# Altium schematic sheet Glands.SchDoc
size Letter; DocumentNumber: 4; SheetNumber: 4; SheetTotal: 11; Pagesize: Letter
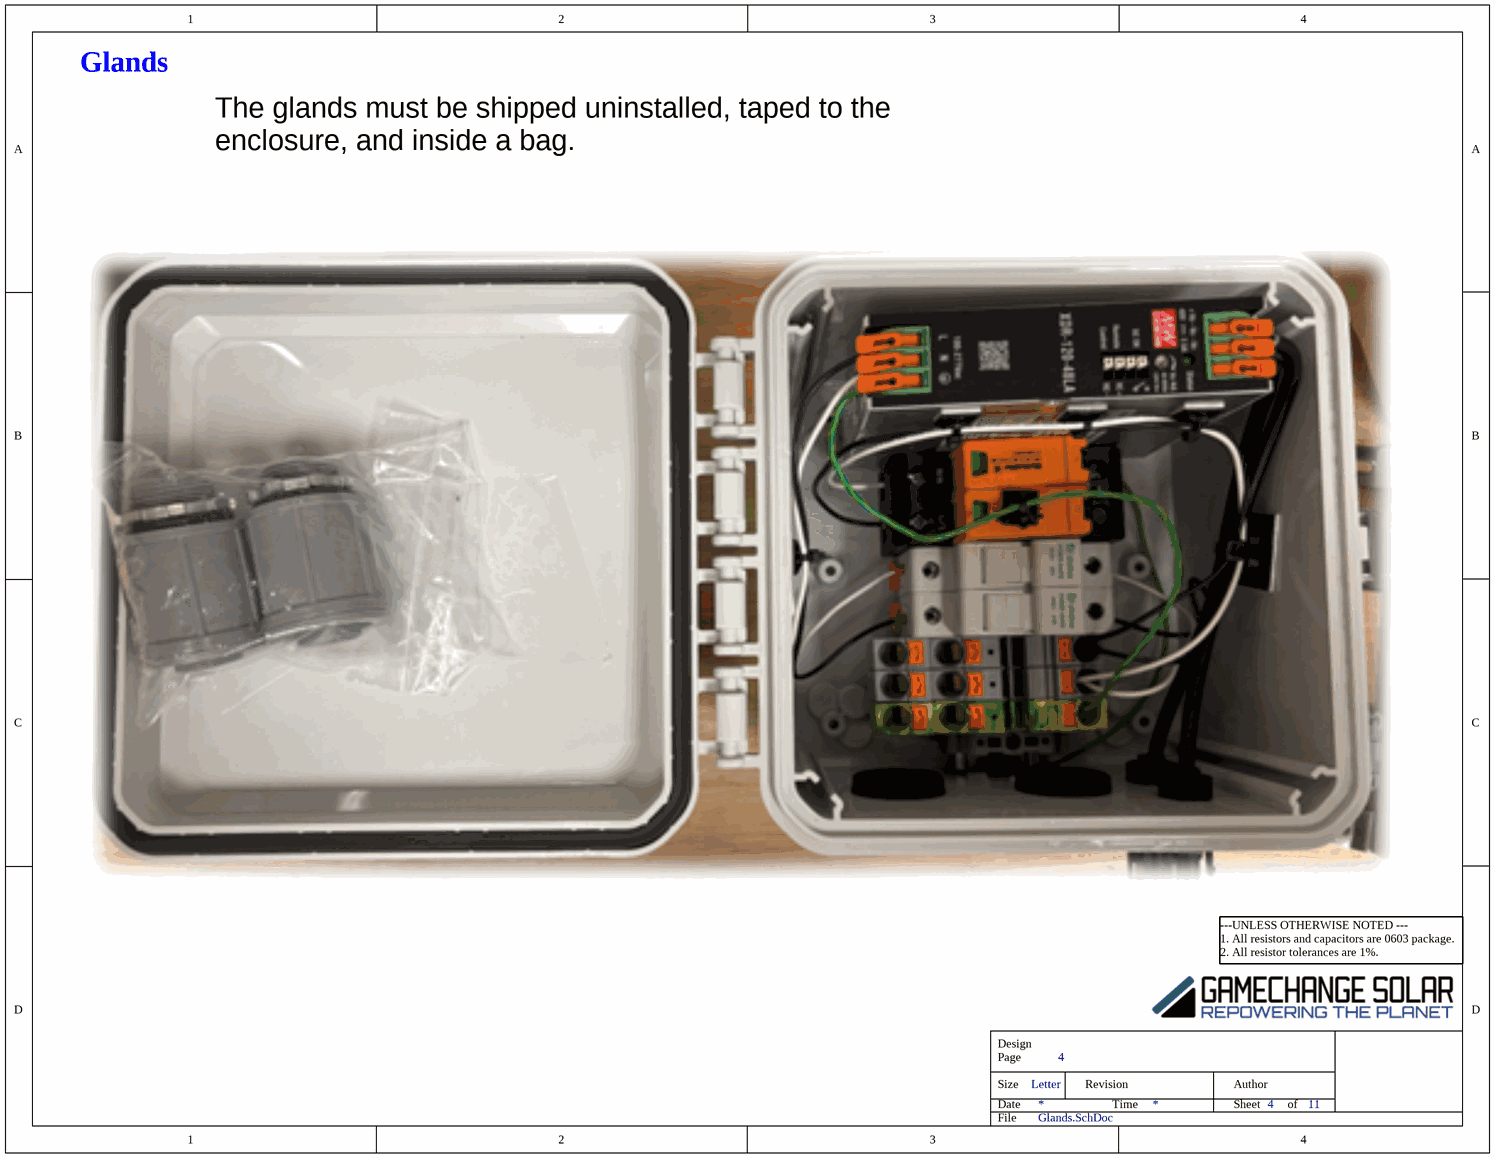
[diagram p0: Glands.SchDoc]

## Notes on the sheet
- Glands
- The glands must be shipped uninstalled, taped to the enclosure, and inside a bag.
- ---UNLESS OTHERWISE NOTED ---
  1. All resistors and capacitors are 0603 package.
  2. All resistor tolerances are 1%.
- Design
- Size
- Date
- Page
- Revision
- Time
- Sheet
- Author
- of
- File